# EAGLE design appleii (EAGLE 9.6.1)
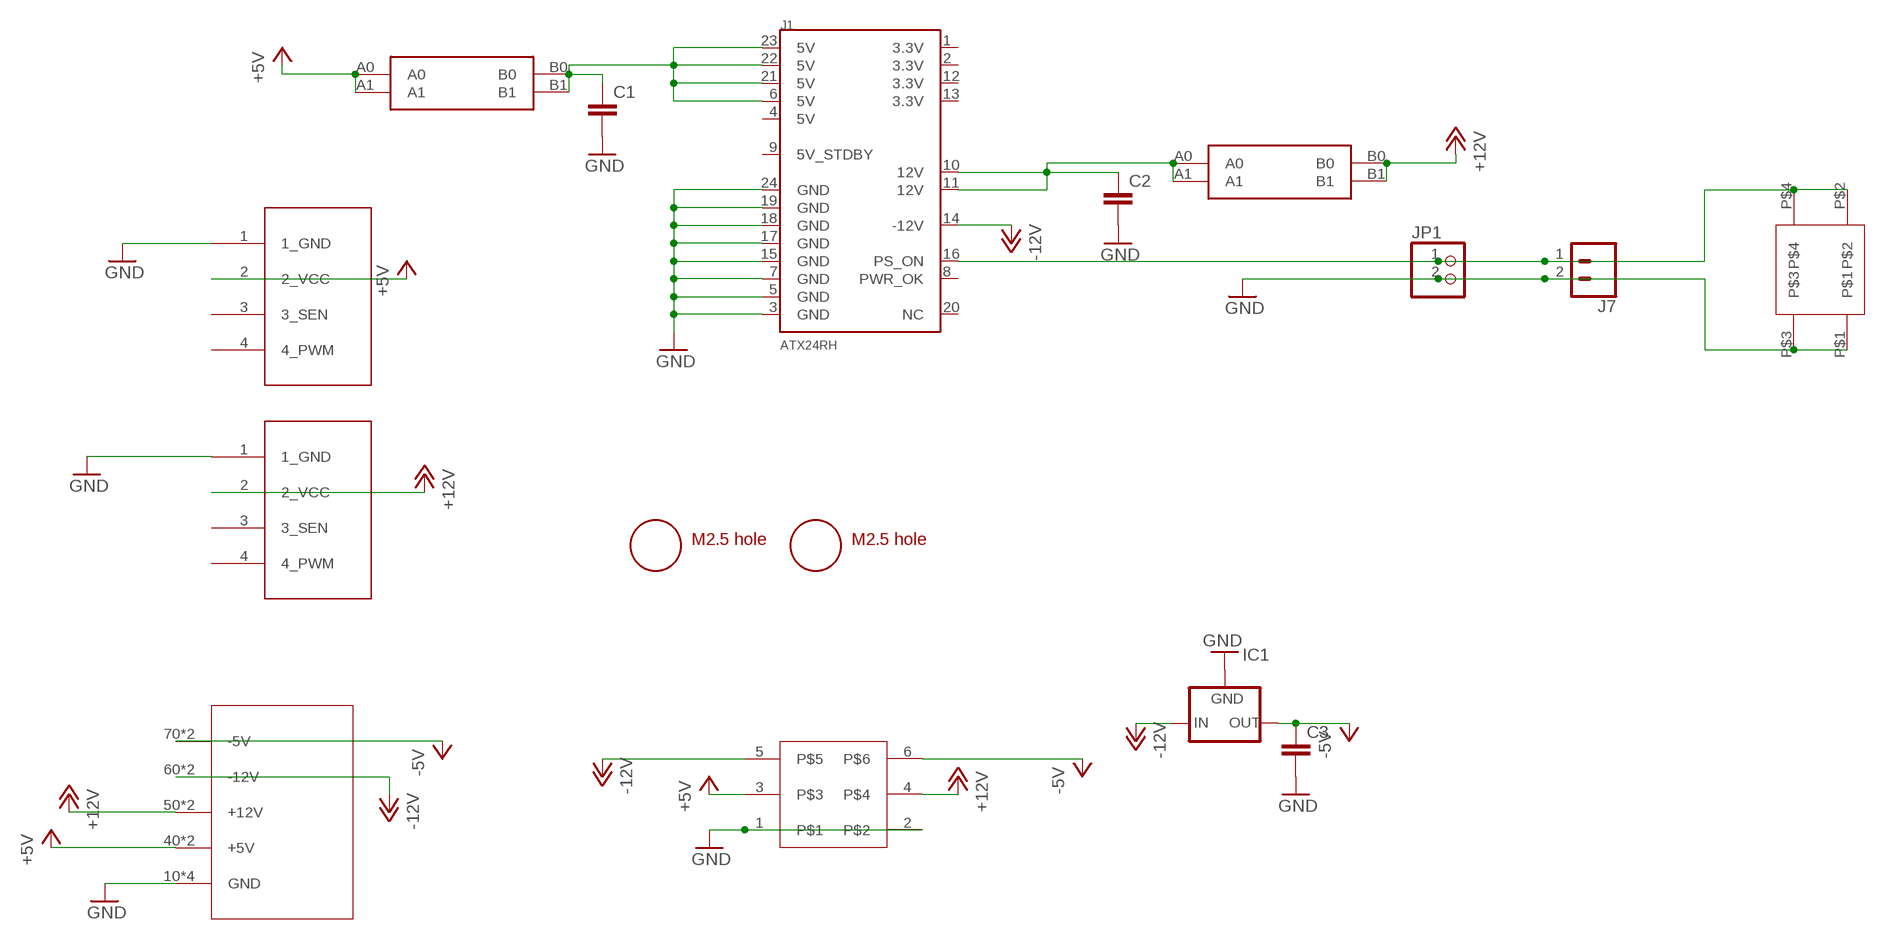
[diagram p0: schematic, sheet 1]

## Parts
C1  C5/2.5  [C5B2.5]
C2  C5/2.5  [C5B2.5]
C3  C5/2.5  [C5B2.5]
IC1  79XXS  [79XXS]
J1  ATX24RH  [ATX24_RIGHT_ANGLE]
J7  CONN_023.5MM-NO_SILK  [SCREWTERMINAL-3.5MM-2-NS]
JP1  PINHD-1X2  [1X02]
JP3  4PIN_FAN  [1X04]
JP4  4PIN_FAN  [1X04]
U$1  CAR_FUSE_HOLDER3IN1  [FUSE_HOLDER_3IN1]
U$2  CAR_FUSE_HOLDER3IN1  [FUSE_HOLDER_3IN1]
U$3  ROCK_SW  [ROCK_SWITCH]
U$4  M2.5_MOUNTING_HOLE  [M3_MOUNTING_HOLE_PACK]
U$5  M2.5_MOUNTING_HOLE  [M3_MOUNTING_HOLE_PACK]
U$6  APPLEII  [APPLEII]
U$7  3.96_FEM_IIGS  [3.96_FEMALE_IIGS_GAP]

## Nets
+5V: JP4.2(2_VCC) U$1.A0 U$1.A1 U$6.3 U$7.40(+5V) U$7.41(+5V)
+12V: JP3.2(2_VCC) U$2.B0 U$2.B1 U$6.4 U$7.50(+12V) U$7.51(+12V)
-5V: C3.1 IC1.OUT U$6.6 U$7.70(-5V) U$7.71(-5V)
-12V: IC1.IN J1.14(-12V) U$6.5 U$7.60(-12V) U$7.61(-12V)
GND: C1.2 C2.2 C3.2 IC1.GND J1.3(GND) J1.5(GND) J1.7(GND) J1.15(GND) J1.17(GND) J1.18(GND) J1.19(GND) J1.24(GND) J7.2 JP1.2 JP3.1(1_GND) JP4.1(1_GND) U$3.P$1 U$3.P$3 U$6.1 U$6.2 U$7.10(GND) U$7.11(GND) U$7.20(GND) U$7.21(GND)
N$5: J1.16(PS_ON) J7.1 JP1.1 U$3.P$2 U$3.P$4
N$6: C1.1 J1.6(5V) J1.21(5V) J1.22(5V) J1.23(5V) U$1.B0 U$1.B1
N$8: C2.1 J1.10(12V) J1.11(12V) U$2.A0 U$2.A1
Unconnected: J1.1(3.3V) J1.2(3.3V) J1.4(5V) J1.8(PWR_OK) J1.9(5V_STDBY) J1.12(3.3V) J1.13(3.3V) J1.20(NC) JP3.3(3_SEN) JP3.4(4_PWM) JP4.3(3_SEN) JP4.4(4_PWM)

## Library data of the parts
C1-C3 = capacitor-wima:C: CAPACITOR naming: grid - package width
IC1 = v-reg:79XXS: VOLTAGE REGULATOR
J1 = macse:ATX24: ATX24 Pin Power Supply Connector This is a good connector for connecting a computer power supply to a PCB. It's massive, but provides many amps of power at 5V and 12V. SKU: PRT-09498
J7 = atx_power_control:CONN_02: Multi connection point. Often used as Generic Header-pin footprint for 0.1 inch spaced/style header connections On any of the 0.1 inch spaced packages, you can populate with these: Break Away Headers - Straight <https://www.sparkfun.com/products/116> (PRT-00116) Break Away Male Headers - Right Angle <https://www.sparkfun.com/products/553> (PRT-00553) Female Headers <https://www.sparkfun.com/products/115> (PRT-00115) Break Away Headers - Machine Pin <https://www.sparkfun.com/products/117> (PRT-00117) Break Away Female Headers - Swiss Machine Pin <https://www.sparkfun.com/products/743> (PRT-00743) For SCREWTERMINALS and SPRING TERMINALS visit here: Screw Terimnals on SparkFun.com <https://www.sparkfun.com/search/results?term=Screw+Terminals> (5mm/3.5mm/2.54mm spacing) This device is also useful as a general connection point to wire up your design to another part of your project. Our various solder wires solder well into these plated through hole pads. Hook-Up Wire - Assortment (Stranded, 22 AWG) <https://www.sparkfun.com/products/11375> (PRT-11375) Hook-Up Wire - Assortment (Solid Core, 22 AWG) <https://www.sparkfun.com/products/11367> (PRT-11367) View the entire wire category on our website here <https://www.sparkfun.com/categories/141> Special notes: Molex polarized connector foot print use with: PRT-08233 with associated crimp pins and housings. 2.54_SCREWTERM for use with PRT-10571. 3.5mm Screw Terminal footprints for PRT-08084 5mm Screw Terminal footprints for use with PRT-08432; PROD_ID: CONN-13512; SF_ID: PRT-09918; SF_SKU: PRT-08432; SKU: PRT-09914
JP1 = pinhead:PINHD-1X2: PIN HEADER
JP3 JP4 = appleii:4PIN_FAN: PIN HEADER
U$1 U$2 = atx_power_control:CAR_FUSE_HOLDER
U$3 = atx4vc:ROCK_SW
U$4 U$5 = appleii:M2.5_MOUNTING_HOLE
U$6 = atx4vc:APPLEII
U$7 = atx4vc:3.96_FEM_IIGS

## Board
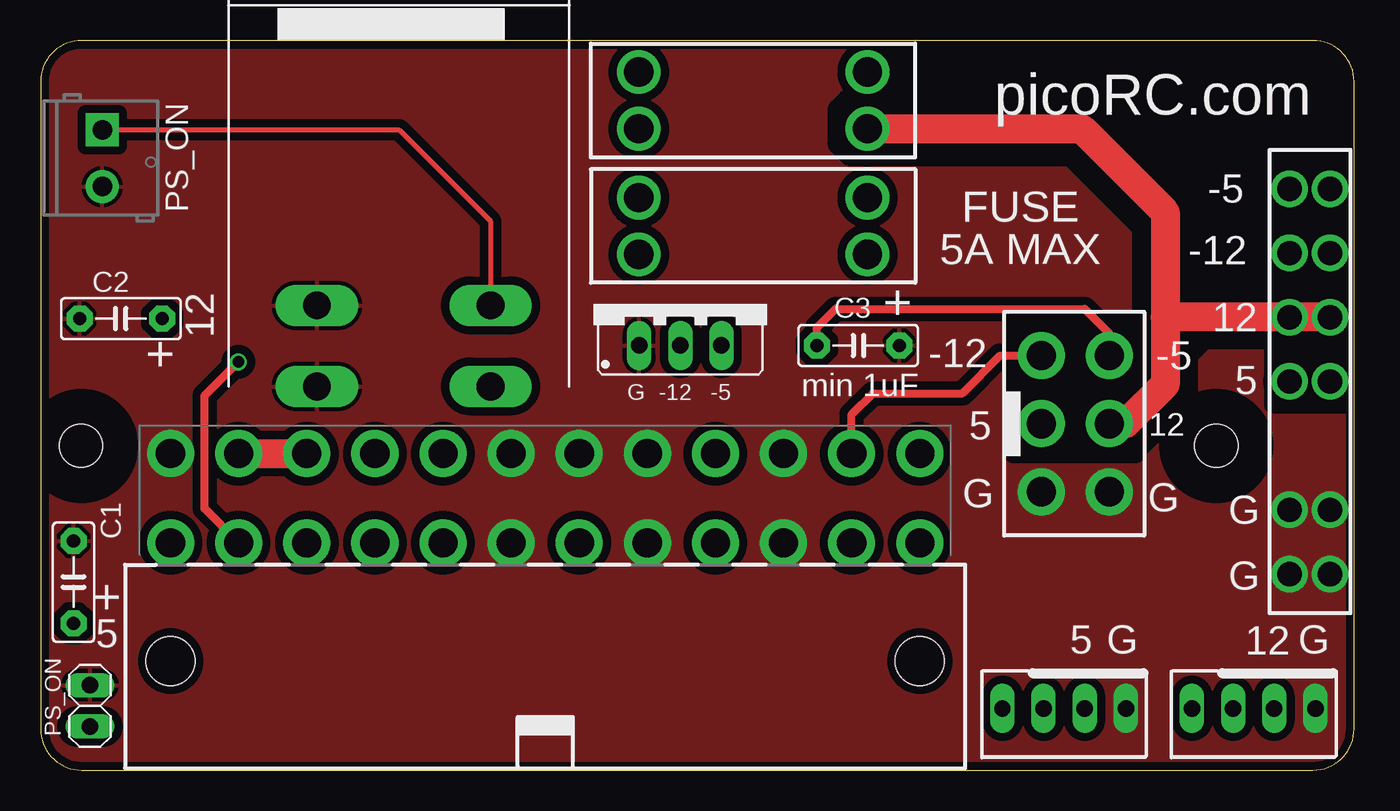
[diagram p1: board, top side]
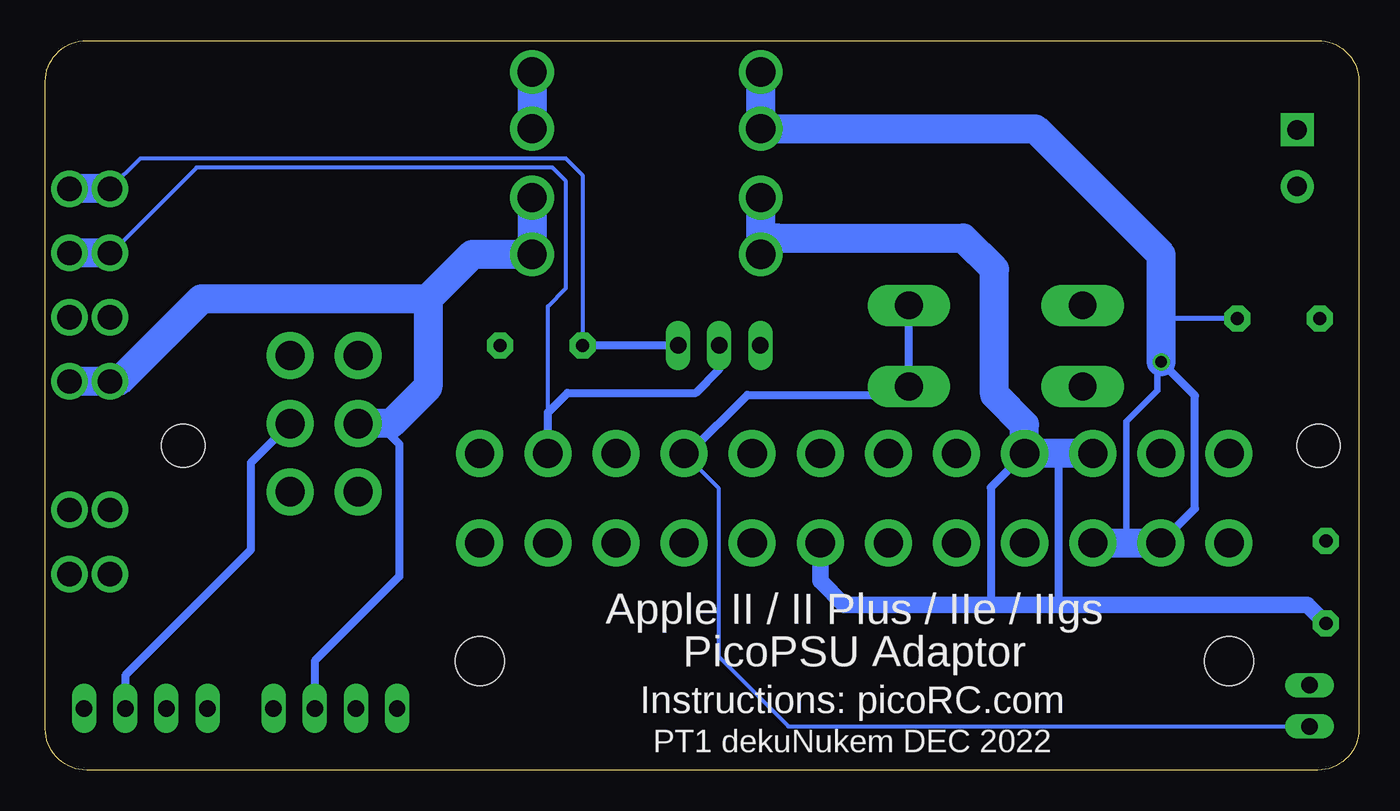
[diagram p2: board, bottom side, seen from below]

Size 81 x 45 mm. Coordinates in mm from the lower left corner, seen from the top.
Outline: 2.54,0 78.46,0 arc90 81,2.54 81,42.46 arc90 78.46,45 2.54,45 arc90 0,42.46 0,2.54 arc90 2.54,0
Copper layers (1*16): Top 0.035mm / dielectric 1.5mm / Bottom 0.035mm
Design rules "deku_2layer_6mil *": minimum track width 6mil, minimum drill 15mil, track to track 12mil, track to pad 12mil, pad to pad 12mil, via to via 12mil, smd to smd 6mil, copper to edge 10mil, drill to drill 6mil, minimum pad ring 7mil, minimum via ring 7mil, stop-mask expansion 4mil, vias tented up to drill 25mil, thermal gap 10mil
tRestrict: area 49.1,19.6 to 81,41.4; area 59.9,19.4 to 67.6,27.8; area 76,22.5 to 80.7,37.5

### Footprints (pad centres in the part's own frame; a part is rotated, then mirrored left to right if it is on the bottom)
C5B2.5 = drill 0.813 pad 1.6 octagon: 1 -2.54,0; 2 2.54,0
79XXS = drill 1.016 long: GND -2.54,-2.54; IN 0,-2.54; OUT 2.54,-2.54
ATX24_RIGHT_ANGLE = drill 1.8 pad 2.9: 1 23.1,4.76; 2 18.9,4.76; 3 14.7,4.76; 4 10.5,4.76; 5 6.3,4.76; 6 2.1,4.76; 7 -2.1,4.76; 8 -6.3,4.76; 9 -10.5,4.76; 10 -14.7,4.76; 11 -18.9,4.76; 12 -23.1,4.76; 13 23.1,10.26; 14 18.9,10.26; 15 14.7,10.26; 16 10.5,10.26; 17 6.3,10.26; 18 2.1,10.26; 19 -2.1,10.26; 20 -6.3,10.26; 21 -10.5,10.26; 22 -14.7,10.26; 23 -18.9,10.26; 24 -23.1,10.26 | hole 3: -23.1,-2.54; 23.1,-2.54
SCREWTERMINAL-3.5MM-2-NS = drill 1.2 pad 2.032 square: 1 0,0 | drill 1.2 pad 2.032: 2 3.5,0
1X02 = drill 1.016 long: 1 -1.27,0; 2 1.27,0
1X04 = drill 1.016 long: 1 -3.81,0; 2 -1.27,0; 3 1.27,0; 4 3.81,0
FUSE_HOLDER_3IN1 = drill 1.8: A0 -7.05,1.75; A1 -7.05,-1.75; B0 7.05,1.75; B1 7.05,-1.75
ROCK_SWITCH = drill 1.7 long: P$1 -5.05,0; P$2 5.65,0; P$3 -5.05,5; P$4 5.65,5
M3_MOUNTING_HOLE_PACK = hole 2.65: 0,0
APPLEII = drill 1.8 pad 2.9: 1 4.2,-2.05; 2 4.2,2.15; 3 0,-2.05; 4 0,2.15; 5 -4.2,-2.05; 6 -4.2,2.15
3.96_FEMALE_IIGS_GAP = drill 1.5: 10 11.88,-1.25; 11 11.88,1.25; 20 7.92,-1.25; 21 7.92,1.25; 40 0,-1.25; 41 0,1.25; 50 -3.96,-1.25; 51 -3.96,1.25; 60 -7.92,-1.25; 61 -7.92,1.25; 70 -11.88,-1.25; 71 -11.88,1.25

### Placement (x,y rotation side)
C1  2.03,11.59 90 top
C2  4.95,27.84 180 top
C3  50.42,26.19 0 top
IC1  39.45,28.73 0 top
J1  31.11,9.26 0 top
J7  3.81,39.5 270 top
JP1  3.05,3.97 90 top
JP3  74.8,3.81 180 top
JP4  63.12,3.81 180 top
U$1  43.94,33.56 180 top
U$2  43.94,41.31 0 top
U$3  22.1,23.66 0 top
U$4  72.5,20 0 top
U$5  2.5,20 0 top
U$6  63.75,21.37 270 top
U$7  78.27,23.97 270 top

### Tracks (layer width: path | path; a pad name or v marks a point on that pad's centre or on a via)
+5V
  Bottom 0.508: U$6.3 60.43,21.37 59.18,20.12 59.18,11.94 64.39,6.73 JP4.2
  Bottom 1.778: U$1.A1 U$1.A0 54.68,31.81 57.4,29.08 | 57.4,29.08 57.4,23.62 59.66,21.37 U$6.3 | 57.4,29.08 71.37,29.08 76.48,23.97 U$7.40 U$7.41
+12V
  Top 1.778: U$2.B1 64.2,39.56 69.34,34.42 69.34,27.94 | U$6.4 66.92,21.37 69.34,23.79 69.34,27.94 | U$7.51 U$7.50 69.35,27.93 69.34,27.94
  Bottom 0.508: U$6.4 68.33,18.95 68.33,13.59 76.07,5.84 JP3.2
  Bottom 1.778: U$2.B0 U$2.B1
-5V
  Top 0.508: C3.1 47.88,27.3 49.02,28.45 64.39,28.45 65.9,26.93 U$6.6
  Bottom 0.254: U$7.70 75.12,37.74 48.92,37.74 47.88,36.7 C3.1
  Bottom 0.508: IC1.OUT C3.1
  Bottom 1.778: U$7.70 U$7.71
-12V
  Top 0.508: J1.14 50.02,21.94 51.32,23.24 56.84,23.24 59.16,25.57 U$6.5
  Bottom 0.254: J1.14 50.02,28.6 48.9,29.72 48.9,36.32 49.73,37.16 71.68,37.16 76.95,31.89 U$7.60
  Bottom 0.508: J1.14 50.02,22.06 48.8,23.27 40.89,23.27 39.45,24.72 IC1.IN
  Bottom 1.778: U$7.60 U$7.61
GND
  pour Top (isolate 0.508): 81,45 0,45 0,-0.06 81,-0.06
N$5
  Top 0.305: J7.1 22.1,39.5 27.75,33.85 U$3.P$4
  Bottom 0.254: J1.16 39.5,17.41 39.5,7.02 35.18,2.7 JP1.1
  Bottom 0.508: J1.16 41.34,19.52 37.72,23.15 28.26,23.15 U$3.P$2 U$3.P$4
N$6
  Top 1.778: J1.23 J1.22
  Bottom 0.508: J1.21 22.71,17.43 22.71,10.19 | 18.52,10.19 18.52,19.52
  Bottom 1.016: J1.6 33.22,11.66 31.75,10.19 22.71,10.19 18.52,10.19 3.17,10.19 C1.1
  Bottom 1.778: J1.22 18.52,19.52 J1.21 20.61,21.29 22.48,23.16 22.48,30.89 24.41,32.83 35.88,32.83 U$1.B0 U$1.B1
N$8  (via drill 0.7)
  Top 0.508: J1.11 10.11,16.13 10.11,23.09 v12.19,25.18
  Bottom 0.305: C2.1 12.19,27.84
  Bottom 0.406: v12.19,25.18 12.45,24.92 12.45,23.41 14.35,21.5 14.35,14.02
  Bottom 0.508: J1.11 10.11,16.13 10.11,23.09 v12.19,25.18
  Bottom 1.778: J1.10 14.35,14.02 J1.11 | v12.19,25.18 12.19,27.84 12.19,31.78 19.97,39.56 U$2.A1 U$2.A0

### Text on the board
tNames: picoRC.com | PS_ON | -5 | FUSE / 5A MAX | -12 | + | 12 | 12 | + | -12 | -5 | min 1uF | 5 | G | -12 | -5 | 5 | 12 | G | G | G | G | + | 5 | 5 | G | 12 | G | PS_ON
bNames: Apple II / II Plus / IIe / IIgs / PicoPSU Adaptor | Instructions: picoRC.com | PT1 dekuNukem DEC 2022